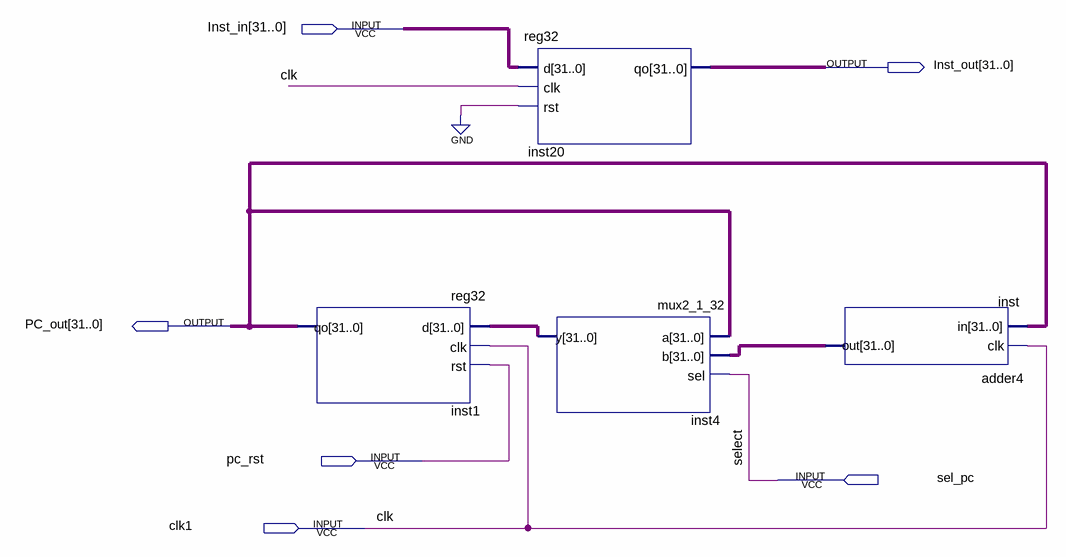
[diagram p0: schematic sheet]
// Quartus schematic IFU.bdf as structural Verilog: 4 symbols, 6 pins
module IFU (
  input  [31:0] Inst_in,
  input  pc_rst,
  input  sel_pc,
  input  clk1,
  output [31:0] Inst_out,
  output [31:0] PC_out
);

  wire [31:0] inst4_y, inst_out_2;

  reg32 inst1 (.d(inst4_y), .clk(clk1), .rst(pc_rst), .qo(PC_out));
  reg32 inst20 (.d(Inst_in), .clk(clk1), .rst(1'b0), .qo(Inst_out));
  mux2_1_32 inst4 (.a(PC_out), .b(inst_out_2), .sel(sel_pc), .y(inst4_y));
  adder4 inst (.clk(clk1), .in(PC_out), .out(inst_out_2));

  // Other names for the same wires on the sheet: clk = clk1; select = sel_pc
endmodule
